# Altium schematic sheet Patil_Sheet_2_20181208.SchDoc: LED DRIVER SCHEMATIC
size B; Date: 22 OCT 2018; DrawnBy: CHINMAY PATIL; Engineer: CHINMAY PATIL; Revision: 2; SheetNumber: 1; SheetTotal: 2
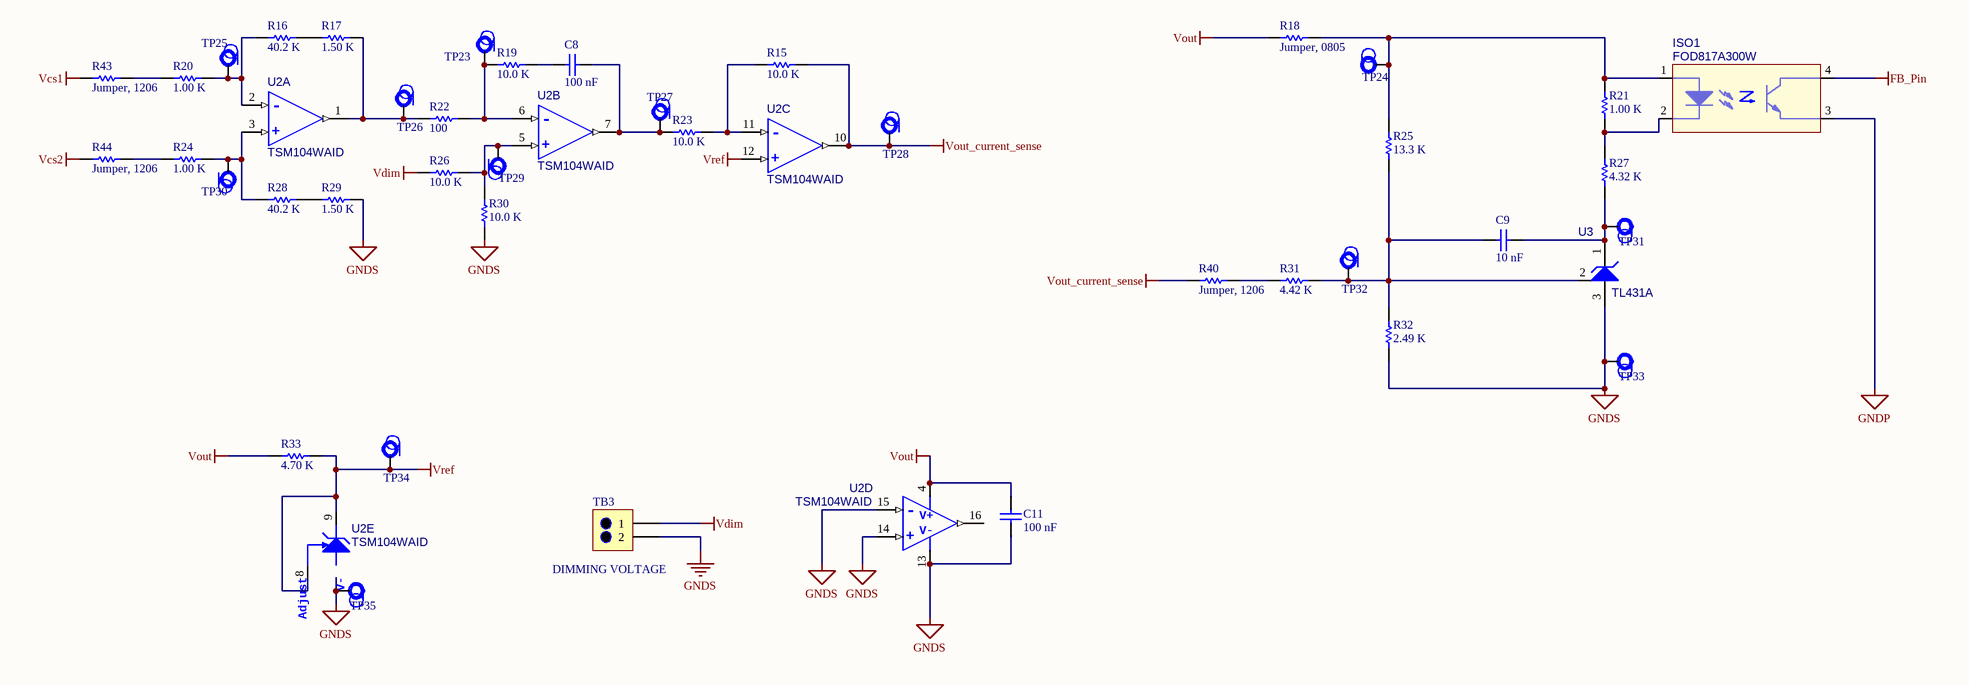
[diagram p0: Patil_Sheet_2_20181208.SchDoc]

## Parts
C8  100 nF  [CAP-1206M_IPC]
C9  10 nF  [CAP-0805M_IPC]
C11  100 nF  [CAP-1206M_IPC]
ISO1  FOD817A300W  [DIP1016W7P254L51H57Q4A_IPC]
R15  10.0 K  [RES-1206M_IPC]
R16  40.2 K  [RES-1206M_IPC]
R17  1.50 K  [RES-1206M_IPC]
R18  Jumper, 0805  [RES-0805M_IPC]
R19  10.0 K  [RES-1206M_IPC]
R20  1.00 K  [RES-1206M_IPC]
R21  1.00 K  [RES-0805M_IPC]
R22  100  [RES-1206M_IPC]
R23  10.0 K  [RES-1206M_IPC]
R24  1.00 K  [RES-1206M_IPC]
R25  13.3 K  [RES-AXIAL-250mW_IPC]
R26  10.0 K  [RES-1206M_IPC]
R27  4.32 K  [RES-1206M_IPC]
R28  40.2 K  [RES-1206M_IPC]
R29  1.50 K  [RES-1206M_IPC]
R30  10.0 K  [RES-1206M_IPC]
R31  4.42 K  [RES-AXIAL-250mW_IPC]
R32  2.49 K  [RES-1206M_IPC]
R33  4.70 K  [RES-2512M_IPC]
R40  Jumper, 1206  [RES-1206M_IPC]
R43  Jumper, 1206  [RES-1206M_IPC]
R44  Jumper, 1206  [RES-1206M_IPC]
TB3  DIMMING VOLTAGE  [CONN_2-POS_TERMINAL_BLOCK_1729128]
TP23  Test Point  [TP_SMT_LOOP-5019_3D]  (value not drawn)
TP24  Test Point  [TP_SMT_LOOP-5019_3D]  (value not drawn)
TP25  Test Point  [TP_SMT_LOOP-5019_3D]  (value not drawn)
TP26  Test Point  [TP_SMT_LOOP-5019_3D]  (value not drawn)
TP27  Test Point  [TP_SMT_LOOP-5019_3D]  (value not drawn)
TP28  Test Point  [TP_SMT_LOOP-5019_3D]  (value not drawn)
TP29  Test Point  [TP_SMT_LOOP-5019_3D]  (value not drawn)
TP30  Test Point  [TP_SMT_LOOP-5019_3D]  (value not drawn)
TP31  Test Point  [TP_SMT_LOOP-5019_3D]  (value not drawn)
TP32  Test Point  [TP_SMT_LOOP-5019_3D]  (value not drawn)
TP33  Test Point  [TP_SMT_LOOP-5019_3D]  (value not drawn)
TP34  Test Point  [TP_SMT_LOOP-5019_3D]  (value not drawn)
TP35  Test Point  [TP_SMT_LOOP-5019_3D]  (value not drawn)
U2  TSM104WAID  [SOIC127P600X175-16M_IPC]  (parts A,B,C,D,E of 5)
U3  TL431A  [SOT95P230X124-3M_IPC]

## Nets
FB_Pin: ISO1.4(Collector)
GNDP: ISO1.3(Emitter)
GNDS: C11.1 R29.2 R30.1 R32.1 TB3.2 TP33.1(GND_TP) TP35.1(GND_TP) U2.13(V-) U2.14(IN+_4) U2.15(IN-_4) U3.3(ANODE)
Vcs1: R43.2
Vcs2: R44.2
Vdim: R26.1 TB3.1
Vout: C11.2 R18.1 R33.1 U2.4(Vcc)
Vout_current_sense: R15.2 R40.2 TP28.1(GND_TP) U2.10(OUT_3)
Vref: R33.2 TP34.1(GND_TP) U2.8(ADJ) U2.9(CATHODE) U2.12(IN+_3)
NetC8_1: C8.1 R19.2
NetC8_2: C8.2 R23.1 TP27.1(GND_TP) U2.7(OUT_2)
NetC9_1: C9.1 R25.1 R31.2 R32.2 TP32.1(GND_TP) U3.2(REF)
NetC9_2: C9.2 R27.1 TP31.1(GND_TP) U3.1(CATHODE)
NetISO1_1: ISO1.1(Anode) R18.2 R21.2 R25.2 TP24.1(GND_TP)
NetISO1_2: ISO1.2(Cathode) R21.1 R27.2
NetR15_1: R15.1 R23.2 U2.11(IN-_3)
NetR16_1: R16.1 R20.1 TP25.1(GND_TP) U2.2(IN-_1)
NetR16_2: R16.2 R17.1
NetR17_2: R17.2 R22.1 TP26.1(GND_TP) U2.1(OUT_1)
NetR19_1: R19.1 R22.2 TP23.1(GND_TP) U2.6(IN-_2)
NetR20_2: R20.2 R43.1
NetR24_1: R24.1 R28.1 TP30.1(GND_TP) U2.3(IN+_1)
NetR24_2: R24.2 R44.1
NetR26_2: R26.2 R30.2 TP29.1(GND_TP) U2.5(IN+_2)
NetR28_2: R28.2 R29.1
NetR31_1: R31.1 R40.1

Not connected (* = marked no-connect by the designer): U2 16(OUT_4)

## Notes on the sheet
- Title
- Size:
- DWG No:
- B
- Rev:
- Sheet
- of
- File:
- (in symbol 11-0006-006, part A) -; +
- (in symbol 11-0006-006, part B) -; +
- (in symbol 11-0006-006, part C) -; +
- (in symbol 11-0006-006, part D) -; V+; +
- (in symbol 11-0006-006, part E) Adjust

## Library data of the parts
C8 C11 = 16-0002-059: Capacitor, Ceramic, 100 nF, ±10%, 50 V, X7R, 1206; Manufacturer: TDK; Manufacturer Part Number: C3216X7R1H104KT; Rated Voltage (V): 50 V; Value: 100 nF; Tolerance: ±10%; Package: 1206; Type: Capacitor, Ceramic; TempCo: X7R; Distributor: Lab Stock; Distributor Part Number: 16-0002-059
C9 = 16-0001-054: Capacitor, Ceramic, 10 nF, ±10%, 50 V, X7R, 0805; Manufacturer: TDK; Manufacturer Part Number: C2012X7R1H103KT; Rated Voltage (V): 50 V; Value: 10 nF; Tolerance: ±10%; Package: 0805; Type: Capacitor, Ceramic; TempCo: X7R; Distributor: Lab Stock; Distributor Part Number: 16-0001-054
ISO1 = 14-0002-002: Opto-coupler, FOD817A300W, DIP, Wide Lead; Manufacturer: ON Semi; Descriptor 3: *; Descriptor 4: *; Descriptor 5: *; Distributor: Digi-Key; Distributor Part Number: FOD817A300W-ND; Industry Number: FOD817A300W; Manufacturer Part Number: FOD817A300W; Notes: *; Package: DIP, Wide Lead; Type: Opto-coupler
R15 R19 R23 R26 R30 = 15-0003-385: Resistor, SMT, 10.0 K, 1%, 250 mW, 1206; Manufacturer: Yageo; Rated Power (W): 250 mW; Distributor: Lab Stock; Distributor Part Number: 15-0003-385; Package: 1206; Tolerance: 1%; Type: Resistor, SMT; Value: 10.0 K
R16 R28 = 15-0003-443: Resistor, SMT, 40.2 K, 1%, 250 mW, 1206; Manufacturer: Yageo; Rated Power (W): 250 mW; Distributor: Lab Stock; Distributor Part Number: 15-0003-443; Package: 1206; Tolerance: 1%; Type: Resistor, SMT; Value: 40.2 K
R17 R29 = 15-0003-306: Resistor, SMT, 1.50 K, 1%, 250 mW, 1206; Manufacturer: Yageo; Rated Power (W): 250 mW; Distributor: Lab Stock; Distributor Part Number: 15-0003-306; Package: 1206; Tolerance: 1%; Type: Resistor, SMT; Value: 1.50 K
R18 = 15-0001-001: Package: 0805
R20 R24 = 15-0003-289: Resistor, SMT, 1.00 K, 1%, 250 mW, 1206; Manufacturer: Yageo; Rated Power (W): 250 mW; Distributor: Lab Stock; Distributor Part Number: 15-0003-289; Package: 1206; Tolerance: 1%; Type: Resistor, SMT; Value: 1.00 K
R21 = 15-0002-289: Resistor, SMT, 1.00 K, 1%, 125 mW, 0805; Manufacturer: Yageo; Rated Power (W): 125 mW; Distributor: Lab Stock; Distributor Part Number: 15-0002-289; Package: 0805; Tolerance: 1%; Type: Resistor, SMT; Value: 1.00 K
R22 = 15-0003-193: Resistor, SMT, 100, 1%, 250 mW, 1206; Manufacturer: Yageo; Rated Power (W): 250 mW; Distributor: Lab Stock; Distributor Part Number: 15-0003-193; Package: 1206; Tolerance: 1%; Type: Resistor, SMT; Value: 100
R25 = 15-0007-397: Resistor, TH, 13.3 K, 1%, 250 mW, MF, Axial; Manufacturer: Yageo; Manufacturer Part Number: MFR-25FBF52-13K3; Rated Power (W): 250 mW; Composition: MF; Distributor: Digi-Key; Distributor Part Number: 13.3KXBK-ND; Package: Axial; Tolerance: 1%; Type: Resistor, TH; Value: 13.3 K
R27 = 15-0003-350: Resistor, SMT, 4.32 K, 1%, 250 mW, 1206; Manufacturer: Yageo; Rated Power (W): 250 mW; Distributor: Lab Stock; Distributor Part Number: 15-0003-350; Package: 1206; Tolerance: 1%; Type: Resistor, SMT; Value: 4.32 K
R31 = 15-0007-351: Resistor, TH, 4.42 K, 1%, 250 mW, MF, Axial; Manufacturer: Yageo; Manufacturer Part Number: MFR-25FBF52-4K42; Rated Power (W): 250 mW; Composition: MF; Distributor: Digi-Key; Distributor Part Number: 4.42KXBK-ND; Package: Axial; Tolerance: 1%; Type: Resistor, TH; Value: 4.42 K
R32 = 15-0003-327: Resistor, SMT, 2.49 K, 1%, 250 mW, 1206; Manufacturer: Yageo; Rated Power (W): 250 mW; Distributor: Lab Stock; Distributor Part Number: 15-0003-327; Package: 1206; Tolerance: 1%; Type: Resistor, SMT; Value: 2.49 K
R33 = 15-0004-114: Resistor, SMT, 4.70 K, 5%, 1 W, 2512; Rated Power (W): 1 W; Distributor: Lab Stock; Distributor Part Number: 15-0004-114; Package: 2512; Tolerance: 5%; Type: Resistor, SMT; Value: 4.70 K
R40 R43 R44 = 15-0001-002: Package: 0805
TB3 = 18-0008-001: Terminal Block, 2 Pos., Vertical, 14-30 AWG, 5.08 mm; Manufacturer: Phoenix Contact; Manufacturer Part Number: 1729128; Package: 2 Pos.; Color: 5.08 mm; Industry Name: Terminal Block; Type: Vertical; Mounting Type: 14-30 AWG; Distributor: Digi-Key; Distributor Part Number: 277-1247-ND
TP23-TP35 = 18-0011-002: Test Point, SMT, Miniature; Manufacturer: Keystone Electronics; Manufacturer Part Number: 5019; Package: SMT; Type: Miniature; Mounting Type: Surface Mount; Industry Name: Test Point; Distributor: Digi-Key; Distributor Part Number: 36-5019CT-ND
U2 = 11-0006-006: Op-Amp With Reference, TSM104WAID, Quad, Low Offset, SOIC-16; Manufacturer: TI; Mfr Part Number: TSM104WAIDR; Distributor: Digi-Key; Distributor Part Number: 296-21202-1-ND; Function: Op-Amp With Reference; Industry Number: TSM104WAID; Notes: *; Package: SOIC-16; Configuration: Quad; Voltage Output: Low Offset
U3 = 11-0008-006: Shunt Regulator, TL431A, Adjustable, 2.495 V, 1%, SOT-23-3; Manufacturer: TI; Mfr Part Number: TL431ACDBZR; Voltage Output: 2.495 V; Distributor: Digi-Key; Distributor Part Number: 296-17328-1-ND; Function: Shunt Regulator; Industry Number: TL431A; Notes: *; Package: SOT-23-3; Configuration: Adjustable; Tolerance: 1%